# Altium schematic sheet LinPOL12-with-SCA.SchDoc: LinPOL12
size A portrait; DrawnBy: anp sxw; Organization: Boston University EDF; DocumentNumber: 18; SheetNumber: 16; SheetTotal: 21
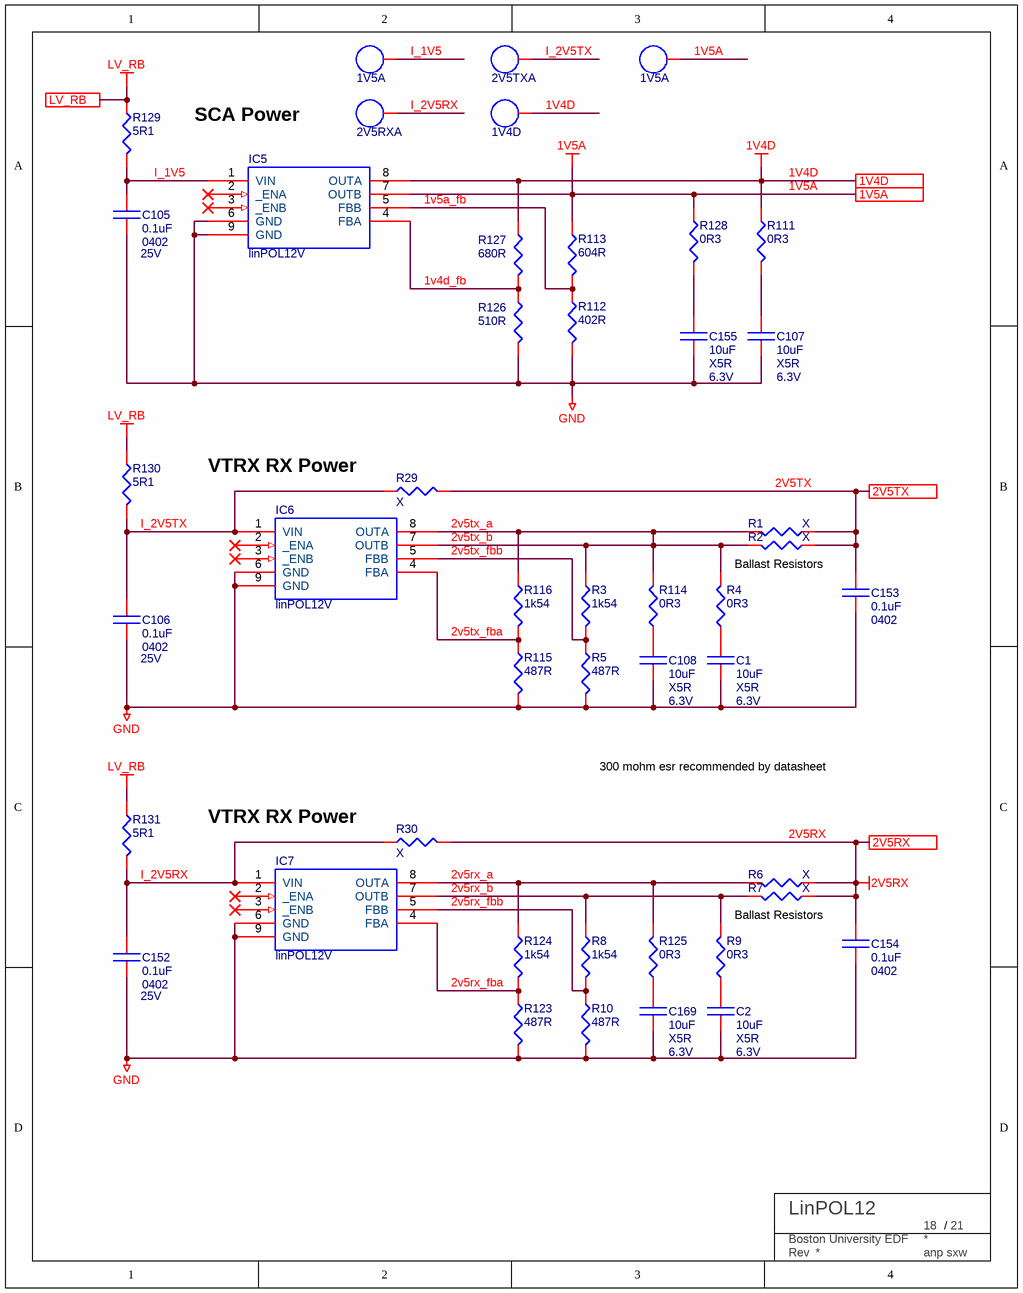
[diagram p0: LinPOL12-with-SCA.SchDoc]

## Parts
C1  TempCo: X5R  Voltage: 6.3V  [C_0603_IPC]  (hidden comment: 10uF)
C2  TempCo: X5R  Voltage: 6.3V  [C_0603_IPC]  (hidden comment: 10uF)
C105  0.1uF  Voltage: 25V  Package: 0402  [C_0402_IPC_NOSILK]
C106  0.1uF  Voltage: 25V  Package: 0402  [C_0402_IPC_NOSILK]
C107  TempCo: X5R  Voltage: 6.3V  [C_0603_IPC]  (hidden comment: 10uF)
C108  TempCo: X5R  Voltage: 6.3V  [C_0603_IPC]  (hidden comment: 10uF)
C152  0.1uF  Voltage: 25V  Package: 0402  [C_0402_IPC_NOSILK]
C153  0.1uF  Package: 0402  [C_0402_IPC_NOSILK]
C154  0.1uF  Package: 0402  [C_0402_IPC_NOSILK]
C155  TempCo: X5R  Voltage: 6.3V  [C_0603_IPC]  (hidden comment: 10uF)
C169  TempCo: X5R  Voltage: 6.3V  [C_0603_IPC]  (hidden comment: 10uF)
IC5  linPOL12V  [WDFNX208]
IC6  linPOL12V  [WDFNX208]
IC7  linPOL12V  [WDFNX208]
R1  X  [R_0402_IPC]
R2  X  [R_0402_IPC]
R3  1k54  [R_0402_IPC]
R4  0R3  [R_0402_IPC]
R5  487R  [R_0402_IPC]
R6  X  [R_0402_IPC]
R7  X  [R_0402_IPC]
R8  1k54  [R_0402_IPC]
R9  0R3  [R_0402_IPC]
R10  487R  [R_0402_IPC]
R29  Parameter 1: X  [resc1005n]  (hidden comment: ERJ-2GEJ201X)
R30  Parameter 1: X  [resc1005n]  (hidden comment: ERJ-2GEJ201X)
R111  0R3  [R_0402_IPC]
R112  402R  [R_0402_IPC]
R113  604R  [R_0402_IPC]
R114  0R3  [R_0402_IPC]
R115  487R  [R_0402_IPC]
R116  1k54  [R_0402_IPC]
R123  487R  [R_0402_IPC]
R124  1k54  [R_0402_IPC]
R125  0R3  [R_0402_IPC]
R126  510R  [resc1005n]
R127  680R  [R_0402_IPC]
R128  0R3  [R_0402_IPC]
R129  5R1  [R_0402_IPC]
R130  5R1  [R_0402_IPC]
R131  5R1  [R_0402_IPC]
TBLOCK?  BU Title block  (value not drawn)  (graphical)
TP8  1V4D  [testpoint]  (no BOM)
TP15  1V5A  [testpoint]  (no BOM)
TP16  2V5RXA  [testpoint]  (no BOM)
TP17  2V5TXA  [testpoint]  (no BOM)
TP?  1V5A  [testpoint]  (no BOM)

## Ports
1V4D, 1V5A, 2V5RX, 2V5TX, LV_RB

## Nets
1V4D: IC5.8(OUTA) R111.1 R127.1 TP8.1(TP) ; port 1V4D
1V5A: IC5.7(OUTB) R113.1 R128.1 TP?.1(TP) ; port 1V5A
2V5RX: C154.1 R6.1 R7.1 R30.2 ; port 2V5RX
GND: C1.2 C2.2 C105.2 C106.2 C107.2 C108.2 C152.2 C153.2 C154.2 C155.2 C169.2 IC5.6(GND) IC5.9(GND) IC6.6(GND) IC6.9(GND) IC7.6(GND) IC7.9(GND) R5.2 R10.2 R112.2 R115.2 R123.2 R126.2
LV_RB: R129.1 R130.1 R131.1 ; port LV_RB
1v4d_fb: IC5.4(FBA) R126.1 R127.2
1v5a_fb: IC5.5(FBB) R112.1 R113.2
2v5rx_a: IC7.8(OUTA) R6.2 R124.1 R125.2
2v5rx_b: IC7.7(OUTB) R7.2 R8.1 R9.2
2v5rx_fba: IC7.4(FBA) R123.1 R124.2
2v5rx_fbb: IC7.5(FBB) R8.2 R10.1
2V5TX: C153.1 R1.1 R2.1 R29.2 ; port 2V5TX
2v5tx_a: IC6.7(OUTB) IC6.8(OUTA) R1.2 R2.2 R3.1 R4.2 R114.2 R116.1  [also labelled 2v5tx_b]
2v5tx_fba: IC6.4(FBA) R115.1 R116.2
2v5tx_fbb: IC6.5(FBB) R3.2 R5.1
I_1V5: C105.1 IC5.1(VIN) R129.2 TP15.1(TP)
I_2V5RX: C152.1 IC7.1(VIN) R30.1 R131.2 TP16.1(TP)
I_2V5TX: C106.1 IC6.1(VIN) R29.1 R130.2 TP17.1(TP)
NetC1_1: C1.1 R4.1
NetC2_1: C2.1 R9.1
NetC107_1: C107.1 R111.2
NetC108_1: C108.1 R114.1
NetC155_1: C155.1 R128.2
NetC169_1: C169.1 R125.1

Not connected (* = marked no-connect by the designer): IC5 2(_ENA)* 3(_ENB)*; IC6 2(_ENA)* 3(_ENB)*; IC7 2(_ENA)* 3(_ENB)*

## Notes on the sheet
- SCA Power
- VTRX RX Power
- Ballast Resistors
- 300 mohm esr recommended by datasheet
- (in symbol TITLE_BLOCK_BU) /; Rev

## Library data of the parts
C1 C2 C107 C108 C155 C169 = C-CER-E6-10uF-0603-6.3V-X5R: GRM185R60J106ME15J; VALUE: 10uF
C105 C106 C152 = C-CER-E5-0.1uF-0402-25V-X7R: GRM155R71E104ME14D; TempCo: X7R
C153 C154 = C-CER-E5-0.1uF-0402-25V-X7R: GRM155R71E104ME14D; Voltage: 25V; TempCo: X7R
R1 R2 R4 R6 R7 R9 R111 R114 R125 R128 = R-E0-0R3-0402-5%: RES 0.3 OHM 5% 1/6W 0402; Part Number: RR0510P-102-D
R3 R8 R116 R124 = R-E3-1K54-0402-0.5%: RES SMD 1.54K OHM 0.5% 1/16W 0402; Part Number: RR0510P-1541-D
R5 R10 R115 R123 = R-E2-487R-0402-0.5%: RES SMD 487 OHM 0.5% 1/16W 0402; Part Number: RR0510P-4870-D
R29 R30 = R1: FILM RESISTOR; Text Field2: 5%
R112 = R-E2-402R-0402-0.5%: RES SMD 402 OHM 0.5% 1/16W 0402; Part Number: RR0510P-4020-D
R113 = R-E2-604R-0402-0.5%: RES SMD 604 OHM 0.5% 1/16W 0402; Part Number: RR0510P-6040-D
R126 = R-E2-510R-0402-0.5%_1: RES SMD 510 OHM 0.5% 1/16W 0402; Part Number: RR0510P-511-D
R127 = R-E2-680R-0402-0.5%: RES SMD 680 OHM 0.5% 1/16W 0402; Part Number: RR0510P-102-D
R129-R131 = R-E0-5R1-0402-5%: RES SMD 5.1 OHM 5% 1/10W 0402
TBLOCK? = TITLE_BLOCK_BU
TP8 TP15-TP17 TP? = TP: TEST POINT 40MIL DIA.